# Altium project chickenguard-upgrade.PrjPcb (part 1 of 2)
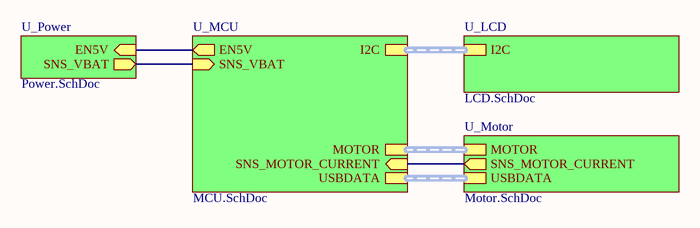
[diagram p0: Main.SchDoc]
board_name: KIPGRD; project_revision: E1.00; Project_link: https://github.com/LieBtrau/chickenguard-2019-upgrade/
5 sheets, 116 parts. Net scope: hierarchical (ports join the sheet entries above them; power ports are global).
Board file: KIPGRDMCU.PcbDoc
Sheets:
  Main.SchDoc
    U_LCD = LCD.SchDoc
    U_MCU = MCU.SchDoc
    U_Motor = Motor.SchDoc
    U_Power = Power.SchDoc

## Sheet Main.SchDoc: Main
size A4; Engineer: CT; SheetNumber: 1; SheetTotal: 5

### Sub-sheets
U_LCD = LCD.SchDoc: I2C (harness I2C)
U_MCU = MCU.SchDoc: I2C (harness I2C), MOTOR (harness MOTOR), EN5V (out), SNS_MOTOR_CURRENT (in), SNS_VBAT (in), USBDATA (harness USBDATA)
U_Motor = Motor.SchDoc: MOTOR (harness MOTOR), SNS_MOTOR_CURRENT (out), USBDATA (harness USBDATA)
U_Power = Power.SchDoc: EN5V (in), SNS_VBAT (out)

### Nets
EN5V: sheet U_MCU/EN5V, sheet U_Power/EN5V
SNS_MOTOR_CURRENT: sheet U_MCU/SNS_MOTOR_CURRENT, sheet U_Motor/SNS_MOTOR_CURRENT
SNS_VBAT: sheet U_MCU/SNS_VBAT, sheet U_Power/SNS_VBAT

### Buses and harness runs
harness sheet U_LCD/I2C = sheet U_MCU/I2C
harness sheet U_MCU/MOTOR = sheet U_Motor/MOTOR
harness sheet U_MCU/USBDATA = sheet U_Motor/USBDATA

### Notes on the sheet
- Title
- Link:
- Size:
- Project:
- Engineer:
- A4
- Date:
- Revision:
- Sheet
- of
- File:

## Sheet LCD.SchDoc: LCD interface
size A4; Engineer: CT; SheetNumber: 3; SheetTotal: 5
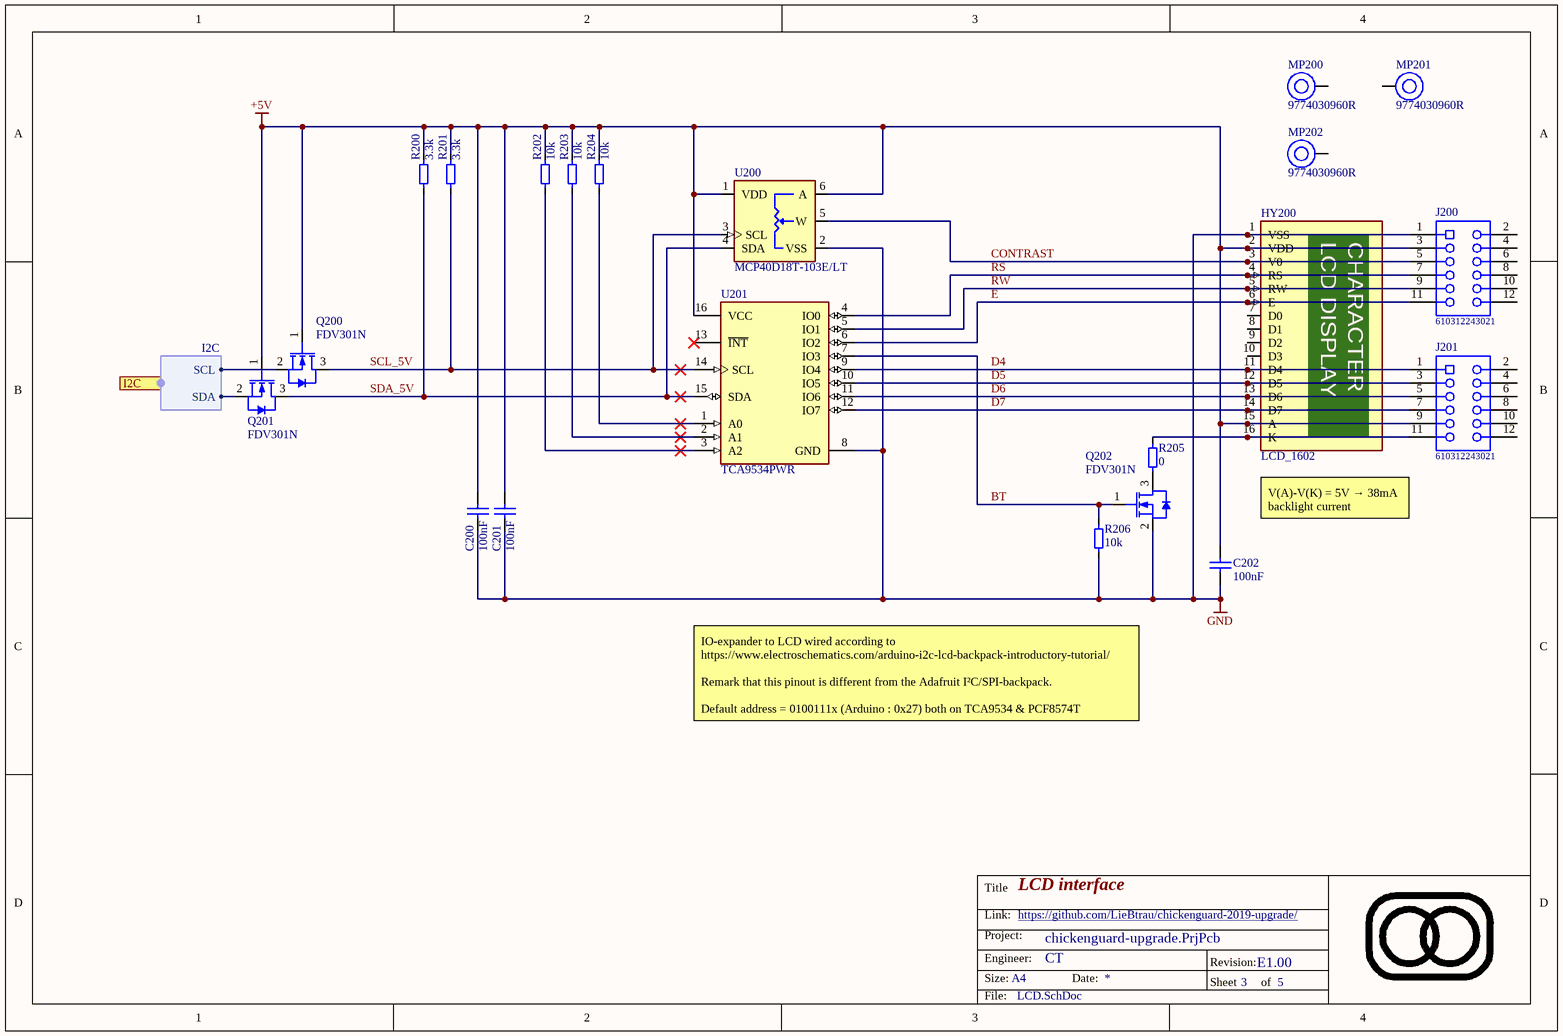
[diagram p1: LCD.SchDoc]

### Parts
C200  value 100nF  [0603-C-N]  (hidden comment: Capacitor 100nF +/-10% 10V X7R 0603)
C201  value 100nF  [0603-C-N]  (hidden comment: Capacitor 100nF +/-10% 10V X7R 0603)
C202  value 100nF  [0603-C-N]  (hidden comment: Capacitor 100nF +/-10% 10V X7R 0603)
HY200  LCD_1602  [LCD_1602-BottomEntry]
J200  610312243021  [610312243021]
J201  610312243021  [610312243021]
MP200  9774030960R  [9774030960]
MP201  9774030960R  [9774030960]
MP202  9774030960R  [9774030960]
Q200  FDV301N  [SOT-23-3-N]
Q201  FDV301N  [SOT-23-3-N]
Q202  FDV301N  [SOT-23-3-N]
R200  value 3.3k  [0603-R-N]  (hidden comment: Resistor 3.3k +/-1% 75V 0603)
R201  value 3.3k  [0603-R-N]  (hidden comment: Resistor 3.3k +/-1% 75V 0603)
R202  value 10k  [0603-R-N]  (hidden comment: Resistor 10k +/-0.05% 75V 0603)
R203  value 10k  [0603-R-N]  (hidden comment: Resistor 10k +/-0.05% 75V 0603)
R204  value 10k  [0603-R-N]  (hidden comment: Resistor 10k +/-0.05% 75V 0603)
R205  value 0  [1206-R-N]  (hidden comment: Jumper 0R <50 mOhm 2A 1206)
R206  value 10k  [0603-R-N]  (hidden comment: Resistor 10k +/-0.05% 75V 0603)
U200  MCP40D18T-103E/LT  [SOT363-N]
U201  TCA9534PWR  [TSSOP16-0.65-4.4-L]

### Ports
I2C (harness I2C)

### Harnesses
I2C: SCL, SDA

### Nets
+5V: C200.2 C201.2 C202.2 HY200.2(VDD) HY200.15(A) J200.3 J201.9 Q200.1(G) Q201.1(G) R200.2 R201.2 R202.2 R203.2 R204.2 U200.1(VDD) U200.6(A) U201.16(VCC)
GND: C200.1 C201.1 C202.1 HY200.1(VSS) J200.1 Q202.2(S) R206.1 U200.2(VSS) U201.8(GND)
BT: Q202.1(G) R206.2 U201.7(IO3)
CONTRAST: HY200.3(V0) J200.5 U200.5(W)
D4: HY200.11(D4) J201.1 U201.9(IO4)
D5: HY200.12(D5) J201.3 U201.10(IO5)
D6: HY200.13(D6) J201.5 U201.11(IO6)
D7: HY200.14(D7) J201.7 U201.12(IO7)
E: HY200.6(E) J200.11 U201.6(IO2)
I2C.SCL: Q200.2(S) ; port I2C.SCL
I2C.SDA: Q201.2(S) ; port I2C.SDA
RS: HY200.4(RS) J200.7 U201.4(IO0)
RW: HY200.5(RW) J200.9 U201.5(IO1)
SCL_5V: Q200.3(D) R201.1 U200.3(SCL) U201.14(SCL)
SDA_5V: Q201.3(D) R200.1 U200.4(SDA) U201.15(SDA)
NetHY200_16: HY200.16(K) J201.11 R205.2
NetQ202_3: Q202.3(D) R205.1
NetR202_1: R202.1 U201.3(A2)
NetR203_1: R203.1 U201.2(A1)
NetR204_1: R204.1 U201.1(A0)

Not connected (* = marked no-connect by the designer): HY200 7(D0) 8(D1) 9(D2) 10(D3); J200 2 4 6 8 10 12; J201 2 4 6 8 10 12; MP200 1; MP201 1; MP202 1; U201 13(~{INT})*

### Notes on the sheet
- V(A)-V(K) = 5V → 38mA backlight current
- IO-expander to LCD wired according to https://www.electroschematics.com/arduino-i2c-lcd-backpack-introductory-tutorial/
  Remark that this pinout is different from the Adafruit I²C/SPI-backpack.
  Default address = 0100111x (Arduino : 0x27) both on TCA9534 & PCF8574T
- Title
- Link:
- Size:
- Project:
- Engineer:
- A4
- Date:
- Revision:
- Sheet
- of
- File:
- (in symbol CMP-000004-14) LCD DISPLAY; CHARACTER

### Library data of the parts
C200-C202 = CMP-072-000541-10: WCAP-CSGP Multilayer Ceramic Chip Capacitor, General Purpose, size 0603, X7R, 100nF, 10VDC; Dissipation Factor: 5%; Capacitor Type: MLCC; Tolerance: 10%; Technical Reference: X7R0603104K010DFCT10000; Insulation Resistance: 5GO; Voltage Rating: 10V; Min Operating Temperature: -55°C; Design Item ID: 885012206020; ComponentLink1URL: https://www.we-online.com/redexpert/article/885012206020?ad; Width: 0.8mm; ComponentLink2URL: https://www.we-online.com/redexpert/spec/885012206020?ad; Mounting Technology: SMT; Pins: 2; Height: 0.8mm; Dielectric: X7R; Packaging: Tape and Reel; ComponentLink1Description: Website Link; Match Code: WCAP-CSGP; ComponentLink2Description: Datasheet Link; Length: 1.6mm; Usage: General Purpose; Max Operating Temperature: 125°C; Case/Package: 0603; Source: WCAP-CSGP.SchLib
HY200 = CMP-000004-14: 2x16 character LCD display
J200 J201 = CMP-045-000113-1: WR-PHD Socket Header, SMT, pitch 2.54mm, Dual Row, Vertical, 12p; Manufacturer: Wurth Elektronik; Pin Number: 12; Rated Current: 3A; Working Voltage: 250VAC; Withstanding Voltage: 500VAC; Contact Resistance: 20mOhm; Gender: Socket Header; Orientation: Vertical; ComponentLink2Description: Datasheet; Operating Temperature: -40 to +125degC; Pitch: 2.54mm; Row Number: Dual; Source: WR-PHD_Socket Header.SchLib; Manufacturer Part Number: 610312243021; Packaging: Tape and Reel; ComponentLink1URL: http://www.we-online.de; Component Type: Standard; Mounting Technology: SMT; ComponentLink2URL: https://www.we-online.com/catalog/datasheet/610312243021.pdf; Pin Count: 12; Design Item ID: 610312243021; ComponentLink1Description: Manufacturer
MP200-MP202 = CMP-002-001388-1: WA-SMST SMT Steel Spacer, OD 6mm, hole 3.3mm x 3mm; Manufacturer: Wurth Elektronik; Surface: Tin; Material: Steel; Inside Diameter: 3.3mm; Design Item ID: 9774030960R; Manufacturer Part Number: 9774030960R; Operating Temperature Min: -55°C; ComponentLink1URL: https://www.we-online.com/redexpert/article/9774030960R?ad; Packaging: Tape and Reel; Operating Temperature Max: 150°C; Component Type: Standard; ComponentLink2URL: https://www.we-online.com/redexpert/spec/9774030960R?ad; Pin Count: 1; Height: 3mm; ComponentLink1Description: Website Link; Mount: Surface Mount; Match Code: WA-SMST; ComponentLink2Description: Datasheet Link; Category: SMT Spacers; Source: WA-SMST.SchLib; Outside Diameter: 6mm
Q200-Q202 = CMP-013-00055-4: Transistor MOSFET N-Ch. 25V 220mA 0, 35W 4Ohm SOT23; Number of Channels: 1; Rise Time: 6ns; Rds On Max: 4R; Vgs (Max): 8V; Max Power Dissipation: 350mW; Input Capacitance: 9.5pF; Polarity: N-CHANNEL; Drain to Source Resistance: 5R; Vgs(th) (Max) @ Id: 1.06V @250µA; Transistor Type: NMOS; Turn-Off Delay Time: 3.5ns; Turn-On Delay Time: 3.2ns; Packaging: Tape and Reel; Series: -; Length: 2.9mm; Weight: 0.001093oz; Continuous Drain Current (ID): 220mA; Width: 1.3mm; Vds Max: 25V; Height: 1.2mm; Mounting Technology: Surface Mount; Gate to Source Voltage (Vgs): 8V; Min Operating Temperature: -55°C; Case/Package: SOT-23-3; Fall Time: 6ns; Id - Continuous Drain Current: 220mA; Pins: 3; Drain to Source Voltage (Vdss): 25V; Max Operating Temperature: 150°C; Package Quantity: 3000
R200 R201 = CMP-009-00243-9: Chip Resistor, Thick Film, General Purpose, 0603, 100mW, 75V, 3.3 kOhm, +/-1%; Tolerance: 1%; Elements: 1; Resistor Type: Thick Film; RoHS Compliant: Yes; Voltage Rating: 75V; Usage: General Purpose; Case/Package: 0603; Pins: 2; Power Rating: 100mW; Mounting Technology: SMT; Min Operating Temperature: -55°C; JLCPCB Part #: C22978; Max Operating Temperature: 155°C
R202-R204 R206 = CMP-009-00182-14: Chip Resistor, Thin Film, Precision, 0603, 100mW, 75V, 10 kOhm, +/-0.05%; Tolerance: 0.05%; Elements: 1; Temperature Coefficient: 10ppm/°C; Power Rating: 100mW; Mounting Technology: SMT; Usage: Precision; Resistor Type: Thin Film; RoHS Compliant: True; Voltage Rating: 75V; Lead Free: Lead Free; Pins: 2; Min Operating Temperature: -55°C; Case/Package: 0603; Packaging: Tape and Reel; Max Operating Temperature: 155°C; Features: Automotive AEC-Q200
R205 = CMP-009-00002-19: Chip Jumper, Thick Film, Jumper, 1206, 250mW, 2A, 0 Ohm, <50 mOhm; Tolerance: 50 mOhm; Elements: 1; Voltage Rating: 200V; Case/Package: 1206; Max Operating Temperature: 155°C; Power Rating: 250mW; RoHS Compliant: True; Resistor Type: Thick Film; Current Rating: 2A; Pins: 2; Usage: Jumper; Min Operating Temperature: -55°C; Mounting Technology: SMT
U200 = CMP-015-00026-1: Digital Potentiometer 10kOhm 128POS Volatile Linear Automotive 6-Pin SC-70 T/R; Value: 10kR; Tolerance: 20%; Min Supply Voltage: 1.8V; Max Supply Voltage: 5.5V; Number of Circuits: 1; Number of Taps: 128; Interface: I2C,Serial,2-Wire; Nominal Supply Current: 45uA; Temperature Coefficient: 150ppm/°C; Case/Package: SC; Packaging: Tape and Reel; Mounting Technology: Surface Mount; Radiation Hardening: No; Length: 2mm; Pins: 6; Width: 1.25mm; Memory Format: Volatile; Resistance Tolerance: 20%; Min Operating Temperature: -40°C; Number of Positions: 128; Max Operating Temperature: 125°C; RoHS Compliant: Yes; Package Quantity: 3000; Height: 0.9mm; Lead Free: Lead Free; Reach SVHC Compliant: Yes; Supply Current: 45uA; Number of Elements: 1
U201 = CMP-000028-10: 8-bit I/O expander, I2C/SMBus, 400kHz, 1.65 to 5.5V, TSSOP-16; Number of I/Os: 8; Interface: I2C; Output Type: PUSH-PULL; RoHS Compliant: Yes; Mounting Technology: Surface Mount; Lead Free: Lead Free; Series: -; Number of Outputs: 8; Packaging: Cut Tape; Max Operating Temperature: 85°C; Min Operating Temperature: -40°C; Pins: 16; Case/Package: TSSOP; Frequency: 400kHz

## Sheet MCU.SchDoc: Microcontroller
size A4; Engineer: CT; SheetNumber: 2; SheetTotal: 5; SPICEModelCacheWAOLYTKC: <root> / <DocumentId>WAOLYTKC</DocumentId> / </root>
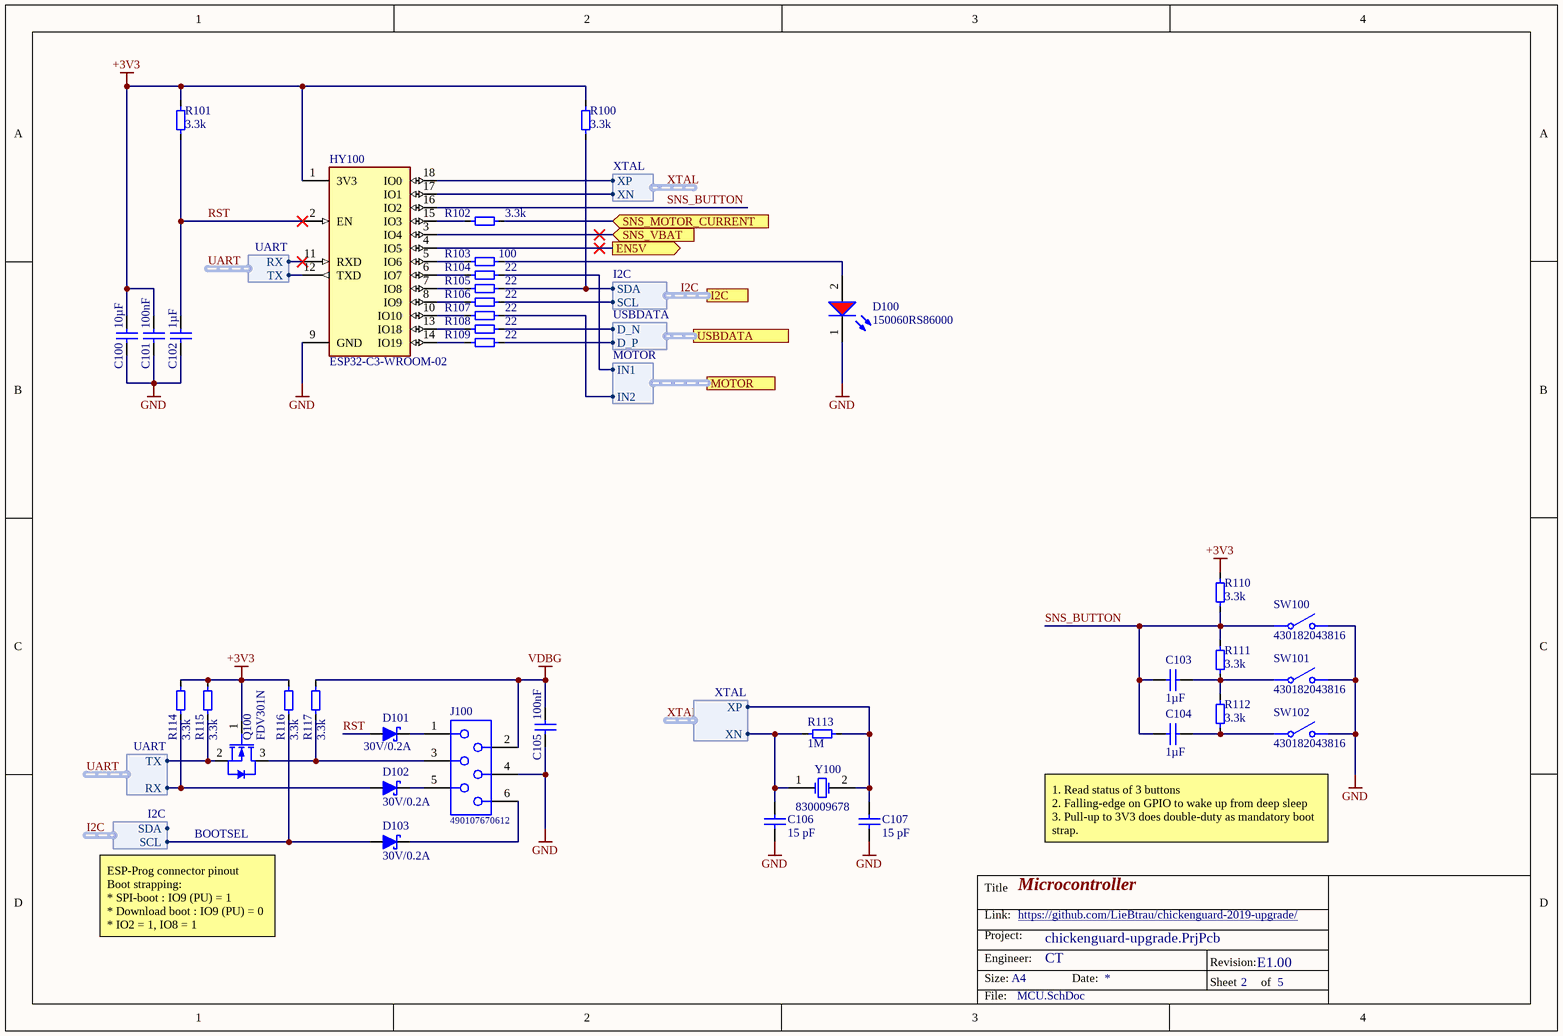
[diagram p2: MCU.SchDoc]

### Parts
C100  value 10µF  [1206-C-L]  (hidden comment: Capacitor 10µF +/-10% 16V X7R 1206)
C101  value 100nF  [0603-C-L]  (hidden comment: Capacitor 100nF +/-10% 10V X7R 0603)
C102  value 1µF  [0603-C-L]  (hidden comment: Capacitor 1µF +/-10% 16V X7R 0603)
C103  value 1µF  [0603-C-L]  (hidden comment: Capacitor 1µF +/-10% 16V X7R 0603)
C104  value 1µF  [0603-C-L]  (hidden comment: Capacitor 1µF +/-10% 16V X7R 0603)
C105  value 100nF  [0603-C-L]  (hidden comment: Capacitor 100nF +/-10% 10V X7R 0603)
C106  value 15 pF  [0603-C-L]  (hidden comment: Capacitor 15 pF +/-5% 50V C0G 0603)
C107  value 15 pF  [0603-C-L]  (hidden comment: Capacitor 15 pF +/-5% 50V C0G 0603)
D100  150060RS86000  [WL-SMCW_0603_150060xx8x000]
D101  value 30V/0.2A  [SOD-123-N]  (hidden comment: BAT54T1G)
D102  value 30V/0.2A  [SOD-123-N]  (hidden comment: BAT54T1G)
D103  value 30V/0.2A  [SOD-123-N]  (hidden comment: BAT54T1G)
HY100  ESP32-C3-WROOM-02  [ESP32­C3­WROOM­02]
J100  490107670612  [490107670612_Debugging Application]  (no BOM)
Q100  FDV301N  [SOT-23-3-N]
R100  value 3.3k  [0603-R-N]  (hidden comment: Resistor 3.3k +/-1% 75V 0603)
R101  value 3.3k  [0603-R-N]  (hidden comment: Resistor 3.3k +/-1% 75V 0603)
R102  value 3.3k  [0603-R-N]  (hidden comment: Resistor 3.3k +/-1% 75V 0603)
R103  value 100  [0603-R-N]  (hidden comment: Resistor 100R +/-1% 75V 0603)
R104  value 22  [0603-R-N]  (hidden comment: Resistor 22R +/-1% 75V 0603)
R105  value 22  [0603-R-N]  (hidden comment: Resistor 22R +/-1% 75V 0603)
R106  value 22  [0603-R-N]  (hidden comment: Resistor 22R +/-1% 75V 0603)
R107  value 22  [0603-R-N]  (hidden comment: Resistor 22R +/-1% 75V 0603)
R108  value 22  [0603-R-N]  (hidden comment: Resistor 22R +/-1% 75V 0603)
R109  value 22  [0603-R-N]  (hidden comment: Resistor 22R +/-1% 75V 0603)
R110  value 3.3k  [0603-R-N]  (hidden comment: Resistor 3.3k +/-1% 75V 0603)
R111  value 3.3k  [0603-R-N]  (hidden comment: Resistor 3.3k +/-1% 75V 0603)
R112  value 3.3k  [0603-R-N]  (hidden comment: Resistor 3.3k +/-1% 75V 0603)
R113  value 1M  [0603-R-N]  (hidden comment: Resistor 1M +/-1% 75V 0603)
R114  value 3.3k  [0603-R-N]  (hidden comment: Resistor 3.3k +/-1% 75V 0603)
R115  value 3.3k  [0603-R-N]  (hidden comment: Resistor 3.3k +/-1% 75V 0603)
R116  value 3.3k  [0603-R-N]  (hidden comment: Resistor 3.3k +/-1% 75V 0603)
R117  value 3.3k  [0603-R-N]  (hidden comment: Resistor 3.3k +/-1% 75V 0603)
SW100  430182043816  [WS-TASV_L6W6H4.3_4301x20438x6]
SW101  430182043816  [WS-TASV_L6W6H4.3_4301x20438x6]
SW102  430182043816  [WS-TASV_L6W6H4.3_4301x20438x6]
Y100  830009678  [WE-XTAL_CFPX-217]

### Ports
EN5V (out), I2C (harness I2C), MOTOR (harness MOTOR), SNS_MOTOR_CURRENT (in), SNS_VBAT (in), USBDATA (harness USBDATA)

### Harnesses
USBDATA: D_N, D_P
XTAL: XN, XP
UART: RX, TX
I2C: SDA, SCL
MOTOR: IN1, IN2

### Nets
+3V3: C100.2 C101.2 HY100.1(3V3) Q100.1(G) R100.2 R101.2 R110.2 R114.2 R115.2 R116.2
GND: C100.1 C101.1 C102.1 C105.1 C106.1 C107.1 D100.1(K) HY100.9(GND) J100.4 SW100.2 SW101.2 SW102.2
VDBG: C105.2 J100.2 R117.2
EN5V: HY100.4(IO5) ; port EN5V
I2C.SCL: D103.2(A) R106.2 R116.1 ; port I2C.SCL
I2C.SDA: R100.1 R105.2 ; port I2C.SDA
RST: C102.2 D101.2(A) HY100.2(EN) R101.1
SNS_BUTTON: C103.1 C104.1 HY100.16(IO2) R110.1 R111.2 SW100.1
SNS_MOTOR_CURRENT: R102.2 ; port SNS_MOTOR_CURRENT
SNS_VBAT: HY100.3(IO4) ; port SNS_VBAT
UART.RX: D102.2(A) HY100.11(RXD) R114.1 ; harness UART.RX
UART.TX: HY100.12(TXD) Q100.2(S) R115.1 ; harness UART.TX
XTAL.XN: C106.2 HY100.17(IO1) R113.1 Y100.1(OSC1) ; harness XTAL.XN
XTAL.XP: C107.2 HY100.18(IO0) R113.2 Y100.2(OSC2) ; harness XTAL.XP
NetC103_2: C103.2 R111.1 R112.2 SW101.1
NetC104_2: C104.2 R112.1 SW102.1
NetD100_2: D100.2(A) R103.2
NetD101_1: D101.1(C) J100.1
NetD102_1: D102.1(C) J100.5
NetD103_1: D103.1(C) J100.6
NetD400_1: R104.2 ; port MOTOR.IN1
NetD400_2: R107.2 ; port MOTOR.IN2
NetD401_1: R109.2 ; port USBDATA.D_P
NetD401_6: R108.2 ; port USBDATA.D_N
NetHY100_5: HY100.5(IO6) R103.1
NetHY100_6: HY100.6(IO7) R104.1
NetHY100_7: HY100.7(IO8) R105.1
NetHY100_8: HY100.8(IO9) R106.1
NetHY100_10: HY100.10(IO10) R107.1
NetHY100_13: HY100.13(IO18) R108.1
NetHY100_14: HY100.14(IO19) R109.1
NetHY100_15: HY100.15(IO3) R102.1
NetJ100_3: J100.3 Q100.3(D) R117.1

### Buses and harness runs
harness I2C = port I2C

### Notes on the sheet
- BOOTSEL
- 1. Read status of 3 buttons
  2. Falling-edge on GPIO to wake up from deep sleep
  3. Pull-up to 3V3 does double-duty as mandatory boot strap.
- ESP-Prog connector pinout
  Boot strapping:
  * SPI-boot : IO9 (PU) = 1
  * Download boot : IO9 (PU) = 0
  * IO2 = 1, IO8 = 1
- Title
- Link:
- Size:
- Project:
- Engineer:
- A4
- Date:
- Revision:
- Sheet
- of
- File:

### Library data of the parts
C100 = CMP-072-000800-12: WCAP-CSGP Multilayer Ceramic Chip Capacitor, General Purpose, size 1206, X7R, 10µF, 16VDC; Technical Reference: X7R1206106K016DFCT10000; Tolerance: 10%; Capacitor Type: MLCC; Insulation Resistance: 0.01GO; Length: 3.2mm; ComponentLink2URL: https://www.we-online.com/redexpert/spec/885012208041?ad; Packaging: Tape and Reel; ComponentLink1Description: Website Link; Design Item ID: 885012208041; Source: WCAP-CSGP.SchLib; ComponentLink2Description: Datasheet Link; Pins: 2; Usage: General Purpose; Voltage Rating: 16V; Height: 1.6mm; ComponentLink1URL: https://www.we-online.com/redexpert/article/885012208041?ad; Dielectric: X7R; Mounting Technology: SMT; Dissipation Factor: 10%; Min Operating Temperature: -55°C; Width: 1.6mm; Max Operating Temperature: 125°C; Case/Package: 1206; Match Code: WCAP-CSGP; JLCPCB Part #: C13585
C101 C105 = CMP-001-00113-8: Capacitor MLCC, General Purpose, size 0603, X7R, 100nF, +/-10%, 10V; Tolerance: 10%; Ripple Current: 10; Capacitor Type: MLCC; Length: 1.6mm; Dielectric: X7R; Height: 0.8mm; Pins: 2; RoHS Compliant: True; Min Operating Temperature: -55°C; Usage: General Purpose; Mounting Technology: SMT; Case/Package: 0603; Width: 0.8mm; Max Operating Temperature: 125°C; Voltage Rating: 10V; JLCPCB Part #: C14663
C102-C104 = CMP-001-00004-18: Capacitor MLCC, General Purpose, size 0603, X7R, 1µF, +/-10%, 16V; Tolerance: 10%; Usage: General Purpose; Mounting Technology: SMT; Width: 0.8mm; Voltage Rating: 16V; RoHS Compliant: True; Capacitor Type: MLCC; Case/Package: 0603; Min Operating Temperature: -55°C; Dielectric: X7R; Pins: 2; Max Operating Temperature: 125°C; Length: 1.6mm; Height: 0.8mm; JLCPCB Part #: C15849
C106 C107 = CMP-001-00107-9: Capacitor MLCC, General Purpose, size 0603, C0G, 15 pF, +/-5%, 50V; Tolerance: 5%; Min Operating Temperature: -55°C; RoHS Compliant: Yes; Dielectric: C0G; Width: 0.8mm; Voltage Rating: 50V; Pins: 2; Height: 0.8mm; Max Operating Temperature: 125°C; Usage: General Purpose; Case/Package: 0603; Mounting Technology: SMT; Capacitor Type: MLCC; Length: 1.6mm
D100 = CMP-002-001080-3: WL-SMCW Mono-color Chip LED Waterclear, size 0603, Red, 2V, 60°; Manufacturer: Wurth Elektronik; Chip Technology: AlInGaP; Case/Size Code: 0603; Luminous Intensity: 800mcd; Dominant Wavelength: 624nm; Peak Wavelength: 632nm; Forward Voltage: 2V; ComponentLink2URL: https://www.we-online.com/redexpert/spec/150060RS86000?ad; Operating Temperature Min: -40°C; ComponentLink1URL: https://www.we-online.com/redexpert/article/150060RS86000?ad; Viewing Angle: 60°; Operating Temperature Max: 85°C; Manufacturer Part Number: 150060RS86000; Packaging: Tape and Reel; ComponentLink2Description: Datasheet Link; Design Item ID: 150060RS86000; Width: 0.8mm; Emitting Color: Red; Length: 1.6mm; Pin Count: 2; Match Code: WL-SMCW; Source: WL-SMCW.SchLib; Height: 0.95mm; Component Type: Standard; Category: Signal LEDs; ComponentLink1Description: Website Link; Mount: Surface Mount
D101-D103 = CMP-004-00035-8: Diode Schottky 30V 200mA (DC) Surface Mount SOD-123; Manufacturer: onsemi; Ir - Reverse Current: 2 uA; Ifsm - Forward Surge Current: 600 mA; Vf - Forward Voltage: 800 mV; Forward Voltage: 800mV; Forward Current If: 200 mA; Reverse Voltage Vr: 30 V; Case/Package: SOD-123; Datasheet: https://www.onsemi.com/products/discrete-power-modules/schottky-diodes-schottky-rectifiers/bat54t; Operating Temperature: -55C to 125C; JLCPCB Part #: C8598; Max Reverse Voltage (DC): 30V; Forward Current: 200mA
HY100 = CMP-019-000004-4: Module with 4 MB flash and on­board PCB antenna / Built around RISC­V single­core SoC / Supporting 2.4 GHz Wi­Fi and Bluetooth 5; pin to pad: 9>0+9; Design Item ID: ESP32-C3-WROOM-02; Source: 7c7_Modules.SchLib; Component Type: Standard; Pin Count: 19
J100 = CMP-002-000028-6: WR-WST REDFIT IDC SKEDD, pitch 2.54mm, 6pins; Contact Resistance max.: 10mOhm; Gender: Transition; Rated Current: 1A; Pin Number: 6; Working Voltage: 100V(AC); Connector Type: Cable,IDC; Design Item ID: 490107670612; Source: WR-WST.SchLib; Packaging: Tube; ComponentLink2Description: Datasheet; Part Number: 490107670612; ComponentLink1Description: Manufacturer; Operating Temperature: -25 to +105degC; Pitch: 2.54mm; ComponentLink1URL: http://www.we-online.de; Published Date: November 2019; Mounting Technology: Press-In; Publisher: Wurth Elektronik; ComponentLink2URL: https://katalog.we-online.com/em/datasheet/490107670612.pdf; RoHS Compliant: Yes; Contact Plating: Gold; Series: REDFIT WR-WST
Q100 = CMP-013-00055-3: Transistor MOSFET N-Ch. 25V 220mA 0, 35W 4Ohm SOT23; Number of Channels: 1; Rise Time: 6ns; Rds On Max: 4R; Vgs (Max): 8V; Max Power Dissipation: 350mW; Input Capacitance: 9.5pF; Polarity: N-CHANNEL; Drain to Source Resistance: 5R; Vgs(th) (Max) @ Id: 1.06V @250µA; Transistor Type: NMOS; Turn-Off Delay Time: 3.5ns; Turn-On Delay Time: 3.2ns; Packaging: Tape and Reel; Series: -; Length: 2.9mm; Weight: 0.001093oz; Continuous Drain Current (ID): 220mA; Width: 1.3mm; Vds Max: 25V; Height: 1.2mm; Mounting Technology: Surface Mount; Gate to Source Voltage (Vgs): 8V; Min Operating Temperature: -55°C; Case/Package: SOT-23-3; Fall Time: 6ns; Id - Continuous Drain Current: 220mA; Pins: 3; Drain to Source Voltage (Vdss): 25V; Max Operating Temperature: 150°C; Package Quantity: 3000
R100-R102 R110-R112 R114-R117 = CMP-009-00243-9: as R200 on sheet LCD; Resistor Type: Thick Film; RoHS Compliant: Yes; Voltage Rating: 75V; Usage: General Purpose; Case/Package: 0603; Pins: 2; Power Rating: 100mW; Mounting Technology: SMT; Min Operating Temperature: -55°C; JLCPCB Part #: C22978; Max Operating Temperature: 155°C
R103 = CMP-009-00232-9: Chip Resistor, Thick Film, General Purpose, 0603, 63mW, 75V, 100 Ohm, +/-1%; Tolerance: 1%; Elements: 1; Temperature Coefficient: 100ppm/°C; Voltage Rating: 75V; Mounting Technology: SMT; Max Operating Temperature: 155°C; Min Operating Temperature: -55°C; Usage: General Purpose; Case/Package: 0603; Pins: 2; JLCPCB Part #: C22775; RoHS Compliant: Yes; Power Rating: 63mW; Resistor Type: Thick Film
R104-R109 = CMP-009-00027-17: Chip Resistor, Thick Film, General Purpose, 0603, 100mW, 75V, 22 Ohm, +/-1%; Tolerance: 1%; Elements: 1; Min Operating Temperature: -55°C; Pins: 2; Case/Package: 0603; Usage: General Purpose; Voltage Rating: 75V; Power Rating: 100mW; Mounting Technology: SMT; Resistor Type: Thick Film; Max Operating Temperature: 155°C; RoHS Compliant: True
R113 = CMP-009-00234-8: Chip Resistor, Thick Film, General Purpose, 0603, 100mW, 75V, 1 MOhm, +/-1%; Tolerance: 1%; Elements: 1; Pins: 2; Mounting Technology: SMT; Max Operating Temperature: 155°C; Power Rating: 100mW; Resistor Type: Thick Film; Usage: General Purpose; RoHS Compliant: Yes; Voltage Rating: 75V; Case/Package: 0603; Min Operating Temperature: -55°C
SW100-SW102 = CMP-002-000142-4: WS-TASV SMT Tact Switch, 12VDC, 50mA, 160g, height 4.3mm; pin to pad: 1>A1+A2 2>B1+B2; Manufacturer: Wurth Elektronik; Electrical Life: 1000000Cycles; Actuator Color: Black; Rated Voltage: 12V; Washable: No; Length: 6mm; Terminal Plating: Silver; ComponentLink2Description: Datasheet; Packaging: Tape and Reel; Terminal Material: Copper Alloy; ComponentLink2URL: https://www.we-online.com/catalog/datasheet/430182043816.pdf; Operating Temperature min.: -40C; Source: WS-TASV.SchLib; Operating Temperature max.: 85C; Mounting Technology: SMT; Contact Plating: Silver; Contact Material: Stainless Steel; Operation Force: 160g; ComponentLink1Description: Manufacturer Link; Manufacturer Part Number: 430182043816; Rated Current: 50mA; Pin Count: 4; Design Item ID: 430182043816; ComponentLink1URL: http://www.we-online.de; Width: 6mm; Height: 4.3mm; Component Type: Standard
Y100 = CMP-030-000070-1: WE-XTAL Watch Crystal, SMT, CFPX-217, 32.768kHz, +/-20ppm; Manufacturer: Wurth Elektronik; Load Capacitance: 12.5pF; Manufacturer Part Number: 830009678; ComponentLink1Description: Manufacturer; Size: CFPX-217; Mounting Technology: SMT; Packaging: Tape and Reel; ComponentLink2URL: https://katalog.we-online.com/pbs/datasheet/830009678.pdf; Frequency Tolerance: +/-20ppm; Operating Temperature: -40 to +85degC; Component Type: Standard; Frequency Stability: -; Design Item ID: 830009678; Frequency: 32.768kHz; Pin Count: 2; ComponentLink1URL: http://www.we-online.de; Published Date: July 2020; Source: WE-XTAL_CFPX-217.SchLib; ComponentLink2Description: Datasheet

## Sheet Motor.SchDoc: Motor + USB
size A4; Engineer: CT; SheetNumber: 5; SheetTotal: 5
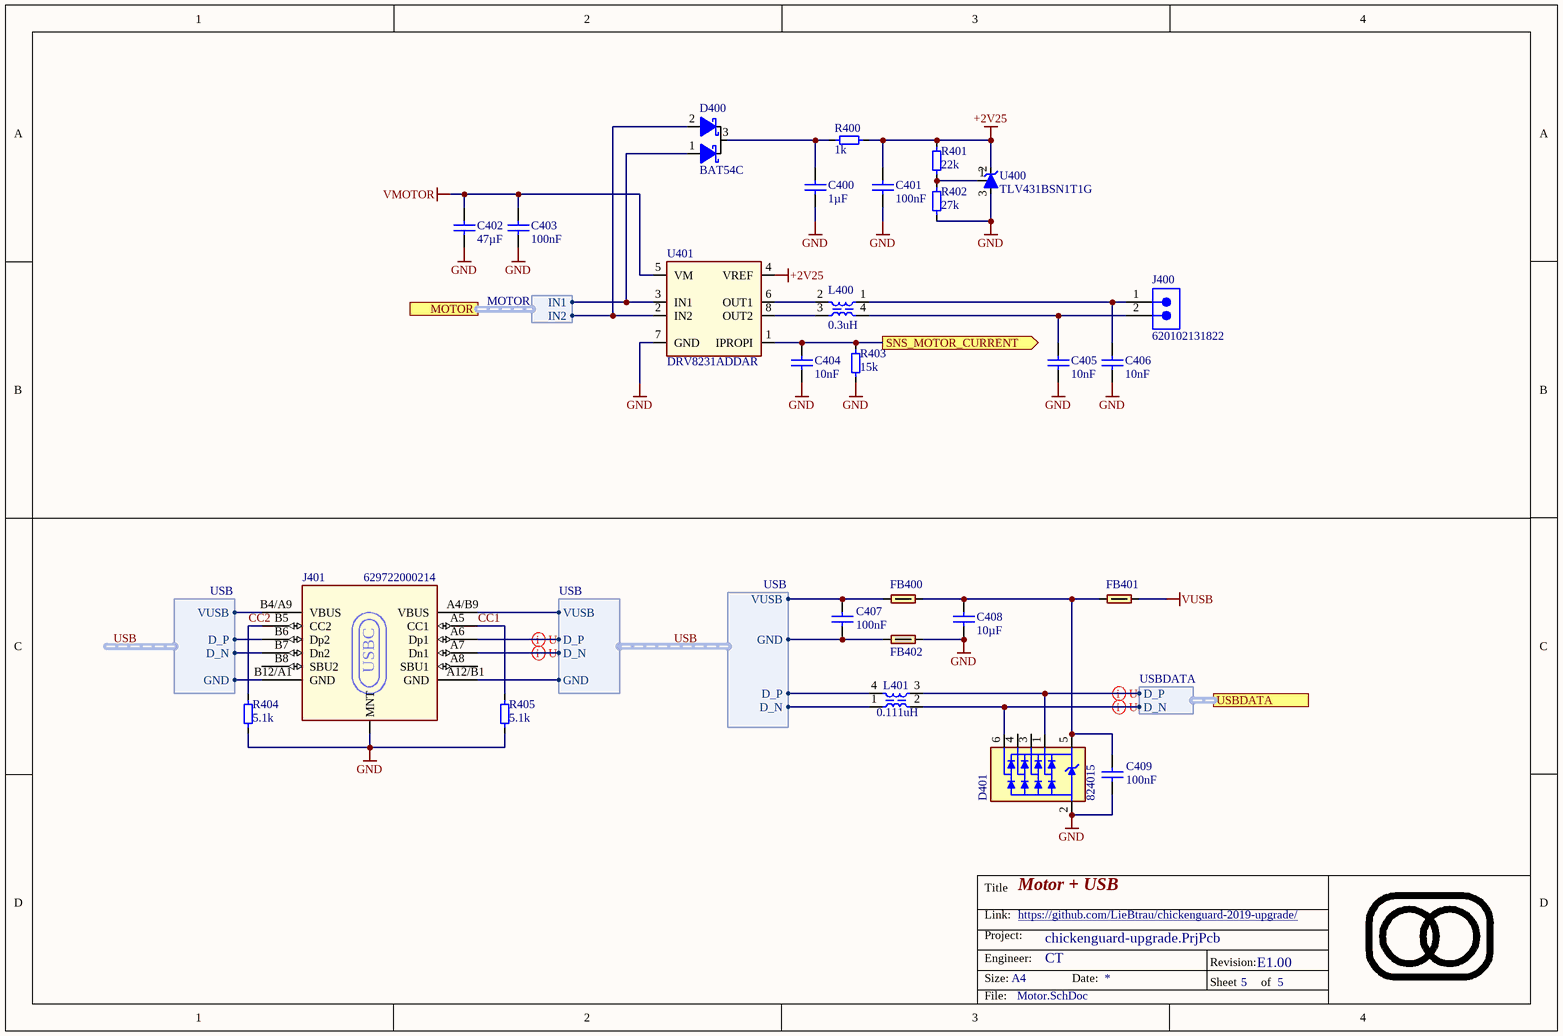
[diagram p3: Motor.SchDoc]

### Parts
C400  value 1µF  [0603-C-N]  (hidden comment: Capacitor 1µF +/-10% 16V X7R 0603)
C401  value 100nF  [0603-C-N]  (hidden comment: Capacitor 100nF +/-10% 10V X7R 0603)
C402  value 47µF  [WCAP-CSGP_1210_L3.2W2.5H2.5]  (hidden comment: Capacitor 47µF +/-20% 16V X5R 1210)
C403  value 100nF  [0603-C-N]  (hidden comment: Capacitor 100nF +/-10% 10V X7R 0603)
C404  value 10nF  [0603-C-N]  (hidden comment: Capacitor 10nF +/-10% 16V X7R 0603)
C405  value 10nF  [0603-C-N]  (hidden comment: Capacitor 10nF +/-10% 16V X7R 0603)
C406  value 10nF  [0603-C-N]  (hidden comment: Capacitor 10nF +/-10% 16V X7R 0603)
C407  value 100nF  [0603-C-N]  (hidden comment: Capacitor 100nF +/-10% 10V X7R 0603)
C408  value 10µF  [1206-C-N]  (hidden comment: Capacitor 10µF +/-10% 16V X7R 1206)
C409  value 100nF  [0603-C-N]  (hidden comment: Capacitor 100nF +/-10% 10V X7R 0603)
D400  BAT54C  [SOT-23-3-N]
D401  824015  [SOT-23-6]
FB400  742792651  [0603-FB-N]  (value not drawn)
FB401  742792651  [0603-FB-N]  (value not drawn)
FB402  742792651  [0603-FB-N]  (value not drawn)
J400  620102131822  [620102131822]
J401  629722000214  [629722000214]
L400  Inductance: 0.3uH  [WE-CNSW_1812]  (hidden comment: 744235900)
L401  Inductance: 0.111uH  [WE-CNSW_1206]  (hidden comment: 744232090)
R400  value 1k  [0603-R-N]  (hidden comment: Resistor 1k +/-1% 75V 0603)
R401  value 22k  [0603-R-N]  (hidden comment: Resistor 22k +/-1% 0.1W 0603)
R402  value 27k  [0603-R-N]  (hidden comment: Resistor 27K +/-1% 0.1W 0603)
R403  value 15k  [0603-R-N]  (hidden comment: Resistor 15k +/- 1% 0.1W 0603)
R404  value 5.1k  [0603-R-N]  (hidden comment: Resistor 5.1k +/-1% 75V 0603)
R405  value 5.1k  [0603-R-N]  (hidden comment: Resistor 5.1k +/-1% 75V 0603)
U400  TLV431BSN1T1G  [SOT-23-3-N]
U401  DRV8231ADDAR  [SOIC8_N_EP]

### Ports
MOTOR (harness MOTOR), SNS_MOTOR_CURRENT (out), USBDATA (harness USBDATA)

### Harnesses
MOTOR: IN1, IN2
USB: VUSB, D_P, D_N, GND
USBDATA: D_P, D_N

### Nets
+2V25: C401.1 R400.1 R401.2 U400.2(C) U401.4(VREF)
GND: C400.2 C401.2 C402.1 C403.2 C404.1 C405.1 C406.1 C408.1 C409.1 D401.2 FB402.2 J401.MNT R402.1 R403.1 R404.1 R405.1 U400.3(A) U401.7(GND)
VMOTOR: C402.2 C403.1 U401.5(VM)
VUSB: FB401.2
CC1: J401.A5(CC1) R405.2
CC2: J401.B5(CC2) R404.2
SNS_MOTOR_CURRENT: C404.2 R403.2 U401.1(IPROPI) ; port SNS_MOTOR_CURRENT
USB.D_N: J401.A7(Dn1) J401.B7(Dn2) L401.1 ; harness USB.D_N
USB.D_P: J401.A6(Dp1) J401.B6(Dp2) L401.4 ; harness USB.D_P
USB.GND: C407.1 FB402.1 J401.A12/B1(GND) J401.B12/A1(GND) ; harness USB.GND
USB.VUSB: C407.2 FB400.1 J401.A4/B9(VBUS) J401.B4/A9(VBUS) ; harness USB.VUSB
NetC400_1: C400.1 D400.3(A) R400.2
NetC405_2: C405.2 J400.2 L400.4
NetC406_2: C406.2 J400.1 L400.1
NetC408_2: C408.2 C409.2 D401.5 FB400.2 FB401.1
NetD400_1: D400.1(C1) U401.3(IN1) ; port MOTOR.IN1
NetD400_2: D400.2(C2) U401.2(IN2) ; port MOTOR.IN2
NetD401_1: D401.1 L401.3 ; port USBDATA.D_P
NetD401_6: D401.6 L401.2 ; port USBDATA.D_N
NetL400_2: L400.2 U401.6(OUT1)
NetL400_3: L400.3 U401.8(OUT2)
NetR401_1: R401.1 R402.2 U400.1(rEF)

Not connected (* = marked no-connect by the designer): D401 3 4; J401 A8(SBU1) B8(SBU2)

### Layout directives
differential pair: NetD401_1, NetD401_6, USB.D_N, USB.D_P

### Notes on the sheet
- Title
- Link:
- Size:
- Project:
- Engineer:
- A4
- Date:
- Revision:
- Sheet
- of
- File:
- (in symbol CMP-088-000027-3) USBC

### Library data of the parts
C400 = CMP-001-00004-18: as C102 on sheet MCU; Usage: General Purpose; Mounting Technology: SMT; Width: 0.8mm; Voltage Rating: 16V; RoHS Compliant: True; Capacitor Type: MLCC; Case/Package: 0603; Min Operating Temperature: -55°C; Dielectric: X7R; Pins: 2; Max Operating Temperature: 125°C; Length: 1.6mm; Height: 0.8mm; JLCPCB Part #: C15849
C401 C403 C407 C409 = CMP-072-000541-10: WCAP-CSGP Multilayer Ceramic Chip Capacitor, General Purpose, size 0603, X7R, 100nF, 10VDC; Capacitor Type: MLCC; Tolerance: 10%; Dissipation Factor: 5%; Technical Reference: X7R0603104K010DFCT10000; Insulation Resistance: 5GO; Length: 1.6mm; Dielectric: X7R; Height: 0.8mm; Pins: 2; Min Operating Temperature: -55°C; Usage: General Purpose; Mounting Technology: SMT; Case/Package: 0603; Width: 0.8mm; Max Operating Temperature: 125°C; Voltage Rating: 10V; Design Item ID: 885012206020; ComponentLink1URL: https://www.we-online.com/redexpert/article/885012206020?ad; ComponentLink2URL: https://www.we-online.com/redexpert/spec/885012206020?ad; Packaging: Tape and Reel; ComponentLink1Description: Website Link; Match Code: WCAP-CSGP; ComponentLink2Description: Datasheet Link; Source: WCAP-CSGP.SchLib
C402 = CMP-072-000445-11: WCAP-CSGP Multilayer Ceramic Chip Capacitor, General Purpose, size 1210, X5R, 47µF, 16VDC; Capacitor Type: MLCC; Technical Reference: X5R1210476M016DFCT10000; Tolerance: 20%; Insulation Resistance: 0.002GO; Dissipation Factor: 10%; Height: 2.5mm; Width: 2.5mm; Mounting Technology: SMT; Source: WCAP-CSGP.SchLib; Length: 3.2mm; Voltage Rating: 16V; Packaging: Tape and Reel; ComponentLink2URL: https://www.we-online.com/redexpert/spec/885012109011?ad; Design Item ID: 885012109011; Case/Package: 1210; Min Operating Temperature: -55°C; Usage: General Purpose; Match Code: WCAP-CSGP; ComponentLink1URL: https://www.we-online.com/redexpert/article/885012109011?ad; Dielectric: X5R; Pins: 2; Max Operating Temperature: 85°C; ComponentLink2Description: Datasheet Link; ComponentLink1Description: Website Link
C404-C406 = CMP-072-000561-10: WCAP-CSGP Multilayer Ceramic Chip Capacitor, General Purpose, size 0603, X7R, 10nF, 16VDC; Capacitor Type: MLCC; Tolerance: 10%; Technical Reference: X7R0603103K016DFCT10000; Insulation Resistance: 10GO; Dissipation Factor: 3.5%; ComponentLink2Description: Datasheet Link; Height: 0.8mm; Mounting Technology: SMT; Source: WCAP-CSGP.SchLib; ComponentLink2URL: https://www.we-online.com/redexpert/spec/885012206040?ad; Match Code: WCAP-CSGP; ComponentLink1Description: Website Link; ComponentLink1URL: https://www.we-online.com/redexpert/article/885012206040?ad; Packaging: Tape and Reel; Design Item ID: 885012206040; Case/Package: 0603; Width: 0.8mm; Length: 1.6mm; Max Operating Temperature: 125°C; Pins: 2; Usage: General Purpose; Dielectric: X7R; Min Operating Temperature: -55°C; Voltage Rating: 16V
C408 = CMP-072-000800-12: WCAP-CSGP Multilayer Ceramic Chip Capacitor, General Purpose, size 1206, X7R, 10µF, 16VDC; Capacitor Type: MLCC; Tolerance: 10%; Technical Reference: X7R1206106K016DFCT10000; Insulation Resistance: 0.01GO; Voltage Rating: 16V; Height: 1.6mm; Pins: 2; Usage: General Purpose; Min Operating Temperature: -55°C; Max Operating Temperature: 125°C; Width: 1.6mm; Dielectric: X7R; Case/Package: 1206; Mounting Technology: SMT; Length: 3.2mm; ComponentLink1URL: https://www.we-online.com/redexpert/article/885012208041?ad; ComponentLink2URL: https://www.we-online.com/redexpert/spec/885012208041?ad; ComponentLink1Description: Website Link; Match Code: WCAP-CSGP; Packaging: Tape and Reel; JLCPCB Part #: C13585; Dissipation Factor: 10%; Design Item ID: 885012208041; Source: WCAP-CSGP.SchLib; ComponentLink2Description: Datasheet Link
D400 = CMP-004-00045-4: Rectifier Diode Small Signal Schottky 30V 0.2A 5ns Automotive 3-Pin SOT-23 T/R; Value: 10pF; Forward Current: 200mA; Current Rating: 200A; Element Configuration: Common Cathode; Max Forward Surge Current (Ifsm): 600mA; Forward Voltage: 800mV; Case/Package: SOT-23-3; Reach SVHC Compliant: Yes; Min Operating Temperature: -55°C; RoHS Compliant: Yes; Termination: SMD/SMT; Pins: 3; Packaging: Tape and Reel; Reverse Recovery Time: 5ns; Lead Free: Lead Free; Voltage: 30V; Max Repetitive Reverse Voltage (Vrrm): 30V; Max Operating Temperature: 150°C; Max Reverse Voltage (DC): 30V
D401 = CMP-034-000015-5: WE-TVS TVS Diode - High Speed Series, SOT23-6L, 4+1Channel, 5Vdc; Manufacturer: Wurth Elektronik; Reverse Breakdown Voltage min.: 6.1V; Channel Input Capacitance: 2pF; Reverse Channel Leakage Current: 2uA; Reverse Peak Pulse Current: 12A; Channel: 4+1; DC Operating Voltage: 5V; Design Item ID: 824015; ComponentLink2URL: https://www.we-online.com/catalog/datasheet/824015.pdf; Operating Temperature: -40 to +125degC; Size: SOT23-6L; Source: WE-TVS.SchLib; ComponentLink1Description: Manufacturer; ComponentLink1URL: http://www.we-online.de; Published Date: April 2020; Packaging: Tape and Reel; Manufacturer Part Number: 824015; Mounting Technology: SMT; ComponentLink2Description: Datasheet; Pin Count: 6; Component Type: Standard
FB400-FB402 = CMP-066-000122-5: WE-CBF SMT EMI Suppression Ferrite Bead, size 0603, 600O, 1A; Manufacturer: Wurth Elektronik; Impedance Max: 800O; Impedance Max Test Condition: 200MHz; Type: High Current; Case/Size Code: 0603; DC Resistance Max: 0.2O; ComponentLink1URL: https://www.we-online.com/redexpert/article/742792651?ad; ComponentLink2Description: Datasheet Link; Operating Temperature Max: 125°C; Manufacturer Part Number: 742792651; Category: Ferrites for PCB Assembly; Pin Count: 2; Design Item ID: 742792651; Match Code: WE-CBF; Operating Temperature Min: -55°C; Length: 1.6mm; Width: 0.8mm; Component Type: Standard; Height: 0.8mm; ComponentLink1Description: Website Link; ComponentLink2URL: https://www.we-online.com/redexpert/spec/742792651?ad; Impedance @100MHz: 600O; Mount: Surface Mount; Rated Current: 1A; Source: WE-CBF.SchLib; Packaging: Tape and Reel
J400 = CMP-047-000040-7: WR-WTB SMT Male Horizontal Shrouded Header, pitch 2mm, 2p; Rated Current: 2A; Pin Number: 2; Working Voltage: 100VAC; Withstanding Voltage: 800VAC; Contact Resistance: 20mOhm; Publisher: Wurth Elektronik; ComponentLink1URL: http://www.we-online.de; Operating Temperature: -25 to +85degC; Pitch: 2mm; Published Date: January 2020; Pin Count: 2; ComponentLink2Description: Datasheet; ComponentLink2URL: https://www.we-online.com/catalog/datasheet/620102131822.pdf; Gender: Male; Part Number: 620102131822; Component Type: Standard; Packaging: Tape and Reel; Type: Horizontal; ComponentLink1Description: Manufacturer; Source: WR-WTB_2.00mm.SchLib; Mounting Technology: SMT; Design Item ID: 620102131822
J401 = CMP-088-000027-3: WR-USB 2.0 Type C, Receptacle, Horizontal, SMT; pin to pad: MNT>S1+S2+S3+S4; Manufacturer: Wurth Elektronik; Number of Ports: 1; Rated Current: 5A; Interface Type: Type C; Working Voltage: 20VAC; Operating Temperature Max: 85°C; Design Item ID: 629722000214; Pin Count: 13; ComponentLink2Description: Datasheet Link; Orientation: Horizontal; Operating Temperature Min: -40°C; Mount: Surface Mount; Match Code: WR-USB; Number of Pins: 16; Source: WR-USB.SchLib; Component Type: Standard; ComponentLink2URL: https://www.we-online.com/redexpert/spec/629722000214?ad; ComponentLink1Description: Website Link; Category: Input/Output Connectors; Packaging: Tape and Reel; Gender: Receptacle; Application: USB 2.0; Manufacturer Part Number: 629722000214; ComponentLink1URL: https://www.we-online.com/redexpert/article/629722000214?ad
L400 = CMP-061-000026-4: WE-CNSW SMT Common Mode Line Filter, size 1812, 90Ohm, 0.3uH, 60V; Manufacturer: Wurth Elektronik; Insulation Test Voltage: 125VAC; Rated Current: 2A; Case/Size Code: 1812; Winding Style: bifiliar; DC Resistance Max: 0.05Ohm; Source: WE-CNSW.SchLib; Width: 3.2mm; Impedance @100MHz: 90Ohm; Rated Voltage: 60V; Category: Common Mode Chokes; ComponentLink1Description: Manufacturer Link; Length: 4.5mm; ComponentLink2URL: https://www.we-online.com/redexpert/spec/744235900?ad; Design Item ID: 744235900; ComponentLink2Description: Datasheet; Manufacturer Part Number: 744235900; Component Type: Standard; Operating Temperature Min: -40°C; Height: 2.8mm; ComponentLink1URL: https://www.we-online.com/redexpert/article/744235900?ad; Match Code: WE-CNSW; Packaging: Tape and Reel; Operating Temperature Max: 125°C; Pin Count: 4; Mount: Surface Mount
L401 = CMP-061-000012-3: WE-CNSW SMT Common Mode Line Filter, size 1206, 90Ohm, 0.111uH, 50V; Manufacturer: Wurth Elektronik; Rated Current: 0.37A; DC Resistance Max: 0.3Ohm; Winding Style: bifiliar; Insulation Test Voltage: 125VAC; Case/Size Code: 1206; ComponentLink2Description: Datasheet; Operating Temperature Min: -40°C; Width: 1.6mm; Length: 3.2mm; Height: 1.8mm; Rated Voltage: 50V; ComponentLink1Description: Manufacturer Link; Pin Count: 4; Design Item ID: 744232090; ComponentLink2URL: https://www.we-online.com/redexpert/spec/744232090?ad; Operating Temperature Max: 125°C; Packaging: Tape and Reel; Impedance @100MHz: 90Ohm; ComponentLink1URL: https://www.we-online.com/redexpert/article/744232090?ad; Source: WE-CNSW.SchLib; Manufacturer Part Number: 744232090; Component Type: Standard; Mount: Surface Mount; Match Code: WE-CNSW; Category: Common Mode Chokes
R400 = CMP-009-00014-19: Chip Resistor, Thick Film, General Purpose, 0603, 100mW, 75V, 1 kOhm, +/-1%; Tolerance: 1%; Elements: 1; Usage: General Purpose; JLCPCB Part #: C21190; Max Operating Temperature: 155°C; Power Rating: 100mW; Min Operating Temperature: -55°C; Mounting Technology: SMT; Resistor Type: Thick Film; Voltage Rating: 75V; Case/Package: 0603; RoHS Compliant: True; Pins: 2
R401 = CMP-009-00245-8: Chip Resistor, Thick Film, General Purpose, 0603, 100mW, 75V, 22 Ohm, +/-1%; Elements: 1; Tolerance: 1%; Usage: General Purpose; RoHS Compliant: Yes; Mounting Technology: SMT; Resistor Type: Thick Film; Min Operating Temperature: -55°C; Voltage Rating: 75V; Max Operating Temperature: 155°C; Power Rating: 100mW; Pins: 2; Case/Package: 0603
R402 = CMP-009-00275-5: Res Thick Film 0603 27K Ohm 1% 0.1W(1/10W) ±100ppm/C Pad SMD Automotive T/R; Usage: General Purpose; Max Power Dissipation: 100mW; Case/Package: 0603; Tolerance: 1%
R403 = CMP-009-00284-4: Res Thick Film 0603 15K Ohm 1% 1/10W ±100ppm/°C Molded SMD Paper T/R; Max Power Dissipation: 100mW; Usage: General Purpose; Voltage Rating: 50V; RoHS Compliant: Yes; Features: Moisture Resistant; Pins: 2; Power Rating: 100mW; Packaging: Tape and Reel; Case Code (Imperial): 0603; Max Operating Temperature: 155°C; Number of Terminations: 2; Resistor Type: Thick Film; Military Standard: Not; Resistance Tolerance: 1%; Height: 0.022inch; Series: RC; Termination: SMD/SMT; Length: 0.063inch; Lead Free: Lead Free; Package Quantity: 1; Case/Package: 0603; Min Operating Temperature: -55°C; Construction: Rectangular; Case Code (Metric): 1608; Width: 0.031inch; Temperature Coefficient: 100ppm/°C; Tolerance: 1%; Depth: 0.8mm; Voltage Rating (DC): 50V
R404 R405 = CMP-009-00192-11: Chip Resistor, Thick Film, General Purpose, 0603, 100mW, 75V, 5.1 kOhm, +/-1%; Temperature Coefficient: 100ppm/°C; Tolerance: 1%; Elements: 1; Case/Package: 0603; Mounting Technology: SMT; Packaging: Cut Tape; Power Rating: 100mW; Min Operating Temperature: -55°C; Pins: 2; Resistor Type: Thick Film; Voltage Rating: 75V; Usage: General Purpose; REACH SVHC: No SVHC; Max Operating Temperature: 155°C
U400 = CMP-019-00078-4: Adjustable Shunt Voltage Reference 1.24 - 16V; +/-0.5%; 3-Pin SOT-23; Tolerance: 0.5%; Min Output Voltage: 1.24V; Reference Type: Shunt,Adjustable; Cathode Current: 80uA; Max Input Voltage: 18V; Output Current: 20mA; Number of Channels: 1; Lead Free: Lead Free; Output Type: Adjustable; Length: 3.04mm; Number of Pins: 3; RoHS Compliant: Yes; Packaging: Tape and Reel; Height: 1.01mm; Mount: Surface Mount; Reach SVHC Compliant: Yes; Package Quantity: 3000; Accuracy: 0.5%; Max Operating Temperature: 85°C; Output Voltage: 16V; Max Output Voltage: 16V; Series: -; Reference Voltage: 1.24V; Sink current: 20mA; Case/Package: SOT-23-3; Output voltage (max): 16V; Min Operating Temperature: -40°C; Radiation Hardening: No; Width: 1.4mm; Halogen Free: Halogen Free; Max Output Current: 20mA
U401 = CMP-001-0029-2: 35-V, 3.7-A H-bridge motor driver with integrated current regulation & current-sense feedback 8-SO PowerPAD -40 to 150; pin to pad: 7>7+9